# Altium schematic sheet CT_MET_2.SchDoc
size A4
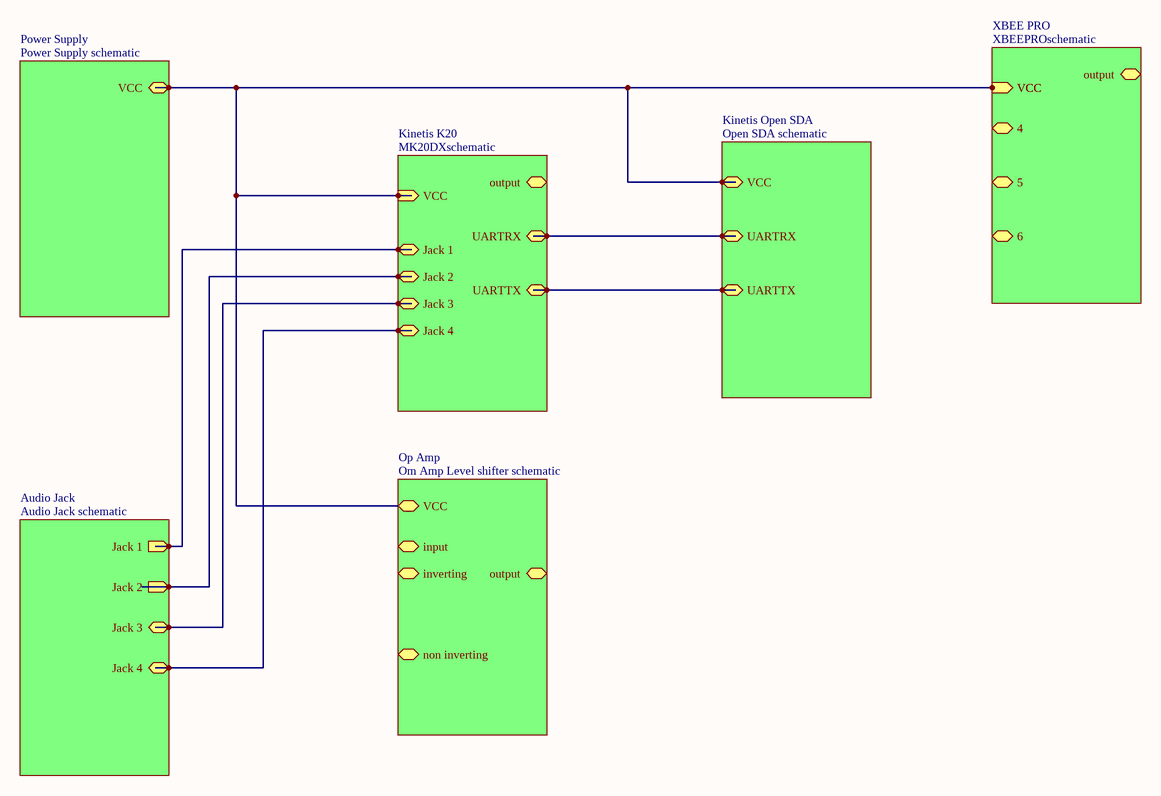
[diagram p0: CT_MET_2.SchDoc]

## Sub-sheets
Audio Jack = Audio Jack schematic: Jack 1 (out), Jack 2 (out), Jack 3, Jack 4
Kinetis K20 = MK20DXschematic: output, UARTRX (bidir), UARTTX (bidir), Jack 4, VCC (in), Jack 3, Jack 2, Jack 1
Kinetis Open SDA = Open SDA schematic: VCC, UARTRX (bidir), UARTTX
Op Amp = Om Amp Level shifter schematic: inverting, output, non inverting, VCC, input
Power Supply = Power Supply schematic: VCC
XBEE PRO = XBEEPROschematic: output, VCC, 4, 5, 6, VCC (in)

## Nets
(unnamed): sheet Op Amp/VCC, sheet Power Supply/VCC, sheet Kinetis K20/VCC, sheet XBEE PRO/VCC, sheet XBEE PRO/VCC, sheet Kinetis Open SDA/VCC
(unnamed): sheet Audio Jack/Jack 1, sheet Kinetis K20/Jack 1
(unnamed): sheet Audio Jack/Jack 2, sheet Kinetis K20/Jack 2
(unnamed): sheet Audio Jack/Jack 3, sheet Kinetis K20/Jack 3
(unnamed): sheet Audio Jack/Jack 4, sheet Kinetis K20/Jack 4
(unnamed): sheet Kinetis K20/UARTRX, sheet Kinetis Open SDA/UARTRX
(unnamed): sheet Kinetis K20/UARTTX, sheet Kinetis Open SDA/UARTTX